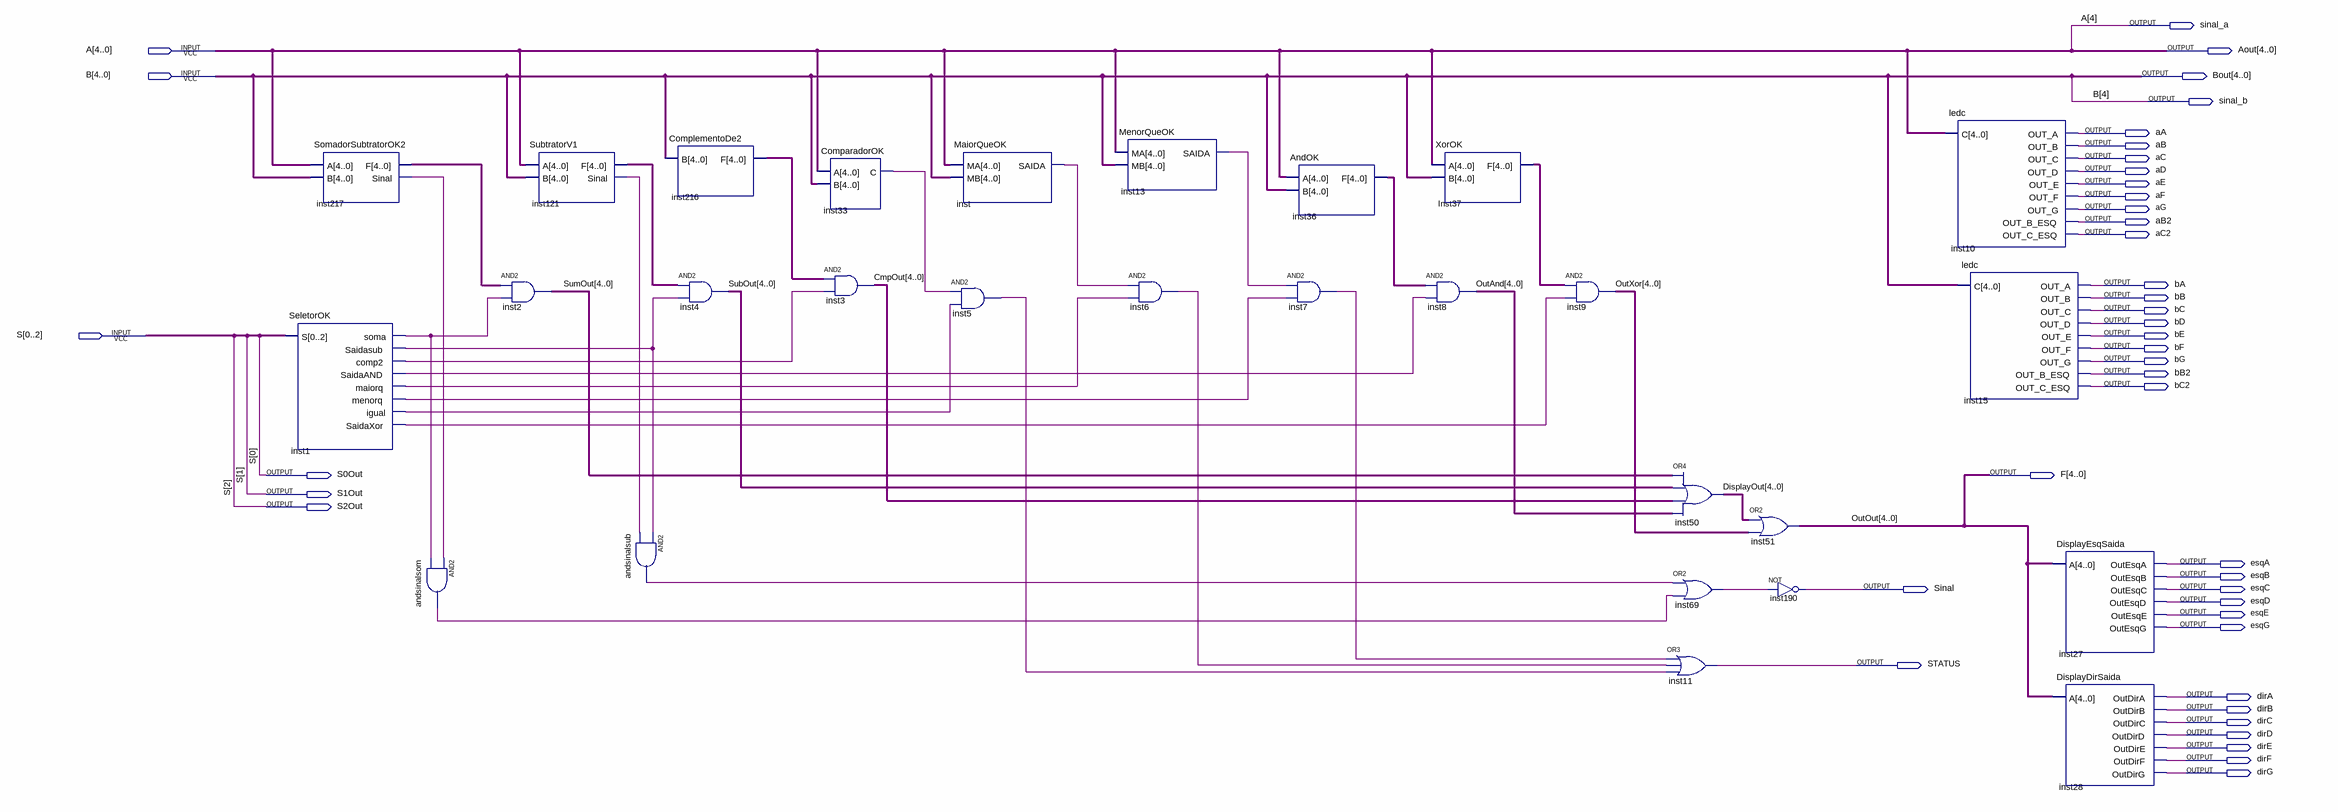
[diagram p0: schematic sheet]
// Quartus schematic ProjetoCompletoOK.bdf as structural Verilog: 28 symbols, 44 pins
module ProjetoCompletoOK (
  input  [4:0] A,
  input  [4:0] B,
  input  [0:2] S,
  output sinal_a,
  output [4:0] Aout,
  output [4:0] Bout,
  output sinal_b,
  output aA,
  output aB,
  output aC,
  output aD,
  output aE,
  output aF,
  output aG,
  output aB2,
  output aC2,
  output bA,
  output bB,
  output bC,
  output bD,
  output bE,
  output bF,
  output bG,
  output bB2,
  output bC2,
  output S0Out,
  output [4:0] F,
  output S1Out,
  output S2Out,
  output esqA,
  output esqB,
  output Sinal,
  output esqC,
  output esqD,
  output esqE,
  output esqG,
  output STATUS,
  output dirA,
  output dirB,
  output dirC,
  output dirD,
  output dirE,
  output dirF,
  output dirG
);

  wire andsinalsom_out, andsinalsub_out, inst1_comp2, inst1_igual, inst1_maiorq, inst1_menorq,
       inst1_saidaand, inst1_saidasub, inst1_saidaxor, inst1_soma, inst5_out, inst6_out, inst7_out,
       inst13_saida, inst33_c, inst69_out, inst121_sinal, inst217_sinal, inst_saida;
  wire [4:0] CmpOut, DisplayOut, inst36_f, Inst37_f, inst121_f, inst216_f, inst217_f, OutAnd, OutXor, SubOut,
       SumOut;

  SeletorOK inst1 (
    .S(S), .soma(inst1_soma), .Saidasub(inst1_saidasub), .comp2(inst1_comp2), .SaidaAND(inst1_saidaand),
    .maiorq(inst1_maiorq), .menorq(inst1_menorq), .igual(inst1_igual), .SaidaXor(inst1_saidaxor));
  SomadorSubtratorOK2 inst217 (.A(A), .B(B), .F(inst217_f), .Sinal(inst217_sinal));
  and andsinalsom (andsinalsom_out, inst217_sinal, inst1_soma);
  SubtratorV1 inst121 (.A(A), .B(B), .F(inst121_f), .Sinal(inst121_sinal));
  assign SumOut = inst217_f & {5{inst1_soma}};  // AND2 inst2, 5 bits wide
  and andsinalsub (andsinalsub_out, inst1_saidasub, inst121_sinal);
  ComplementoDe2 inst216 (.B(B), .F(inst216_f));
  assign SubOut = inst121_f & {5{inst1_saidasub}};  // AND2 inst4, 5 bits wide
  ComparadorOK inst33 (.A(A), .B(B), .C(inst33_c));
  assign CmpOut = inst216_f & {5{inst1_comp2}};  // AND2 inst3, 5 bits wide
  MaiorQueOK inst (.MA(A), .MB(B), .SAIDA(inst_saida));
  and inst5 (inst5_out, inst33_c, inst1_igual);
  MenorQueOK inst13 (.MA(A), .MB(B), .SAIDA(inst13_saida));
  and inst6 (inst6_out, inst_saida, inst1_maiorq);
  AndOK inst36 (.A(A), .B(B), .F(inst36_f));
  and inst7 (inst7_out, inst13_saida, inst1_menorq);
  XorOK Inst37 (.A(A), .B(B), .F(Inst37_f));
  assign OutAnd = inst36_f & {5{inst1_saidaand}};  // AND2 inst8, 5 bits wide
  assign OutXor = Inst37_f & {5{inst1_saidaxor}};  // AND2 inst9, 5 bits wide
  assign DisplayOut = SumOut | SubOut | CmpOut | OutAnd;  // OR4 inst50, 5 bits wide
  or inst69 (inst69_out, andsinalsub_out, andsinalsom_out);
  or inst11 (STATUS, inst7_out, inst6_out, inst5_out);
  assign F = DisplayOut | OutXor;  // OR2 inst51, 5 bits wide
  not inst190 (Sinal, inst69_out);
  ledc inst10 (
    .C(A), .OUT_A(aA), .OUT_B(aB), .OUT_C(aC), .OUT_D(aD), .OUT_E(aE), .OUT_F(aF), .OUT_G(aG),
    .OUT_B_ESQ(aB2), .OUT_C_ESQ(aC2));
  ledc inst15 (
    .C(B), .OUT_A(bA), .OUT_B(bB), .OUT_C(bC), .OUT_D(bD), .OUT_E(bE), .OUT_F(bF), .OUT_G(bG),
    .OUT_B_ESQ(bB2), .OUT_C_ESQ(bC2));
  DisplayEsqSaida inst27 (
    .A(F), .OutEsqA(esqA), .OutEsqB(esqB), .OutEsqC(esqC), .OutEsqD(esqD), .OutEsqE(esqE), .OutEsqG(esqG));
  DisplayDirSaida inst28 (
    .A(F), .OutDirA(dirA), .OutDirB(dirB), .OutDirC(dirC), .OutDirD(dirD), .OutDirE(dirE), .OutDirF(dirF),
    .OutDirG(dirG));

  assign Aout = A;
  assign Bout = B;
  assign S0Out = S[0];
  assign S1Out = S[1];
  assign S2Out = S[2];
  assign sinal_a = A[4];
  assign sinal_b = B[4];

  // Other names for the same wires on the sheet: OutOut[4:0] = F
endmodule
